# Altium schematic sheet PWR_F.SchDoc
size A3; Organization: Altium Limited; Address1: L3, 12a Rodborough Rd; Address2: Frenchs Forest; Address3: NSW; Address4: Australia 2086
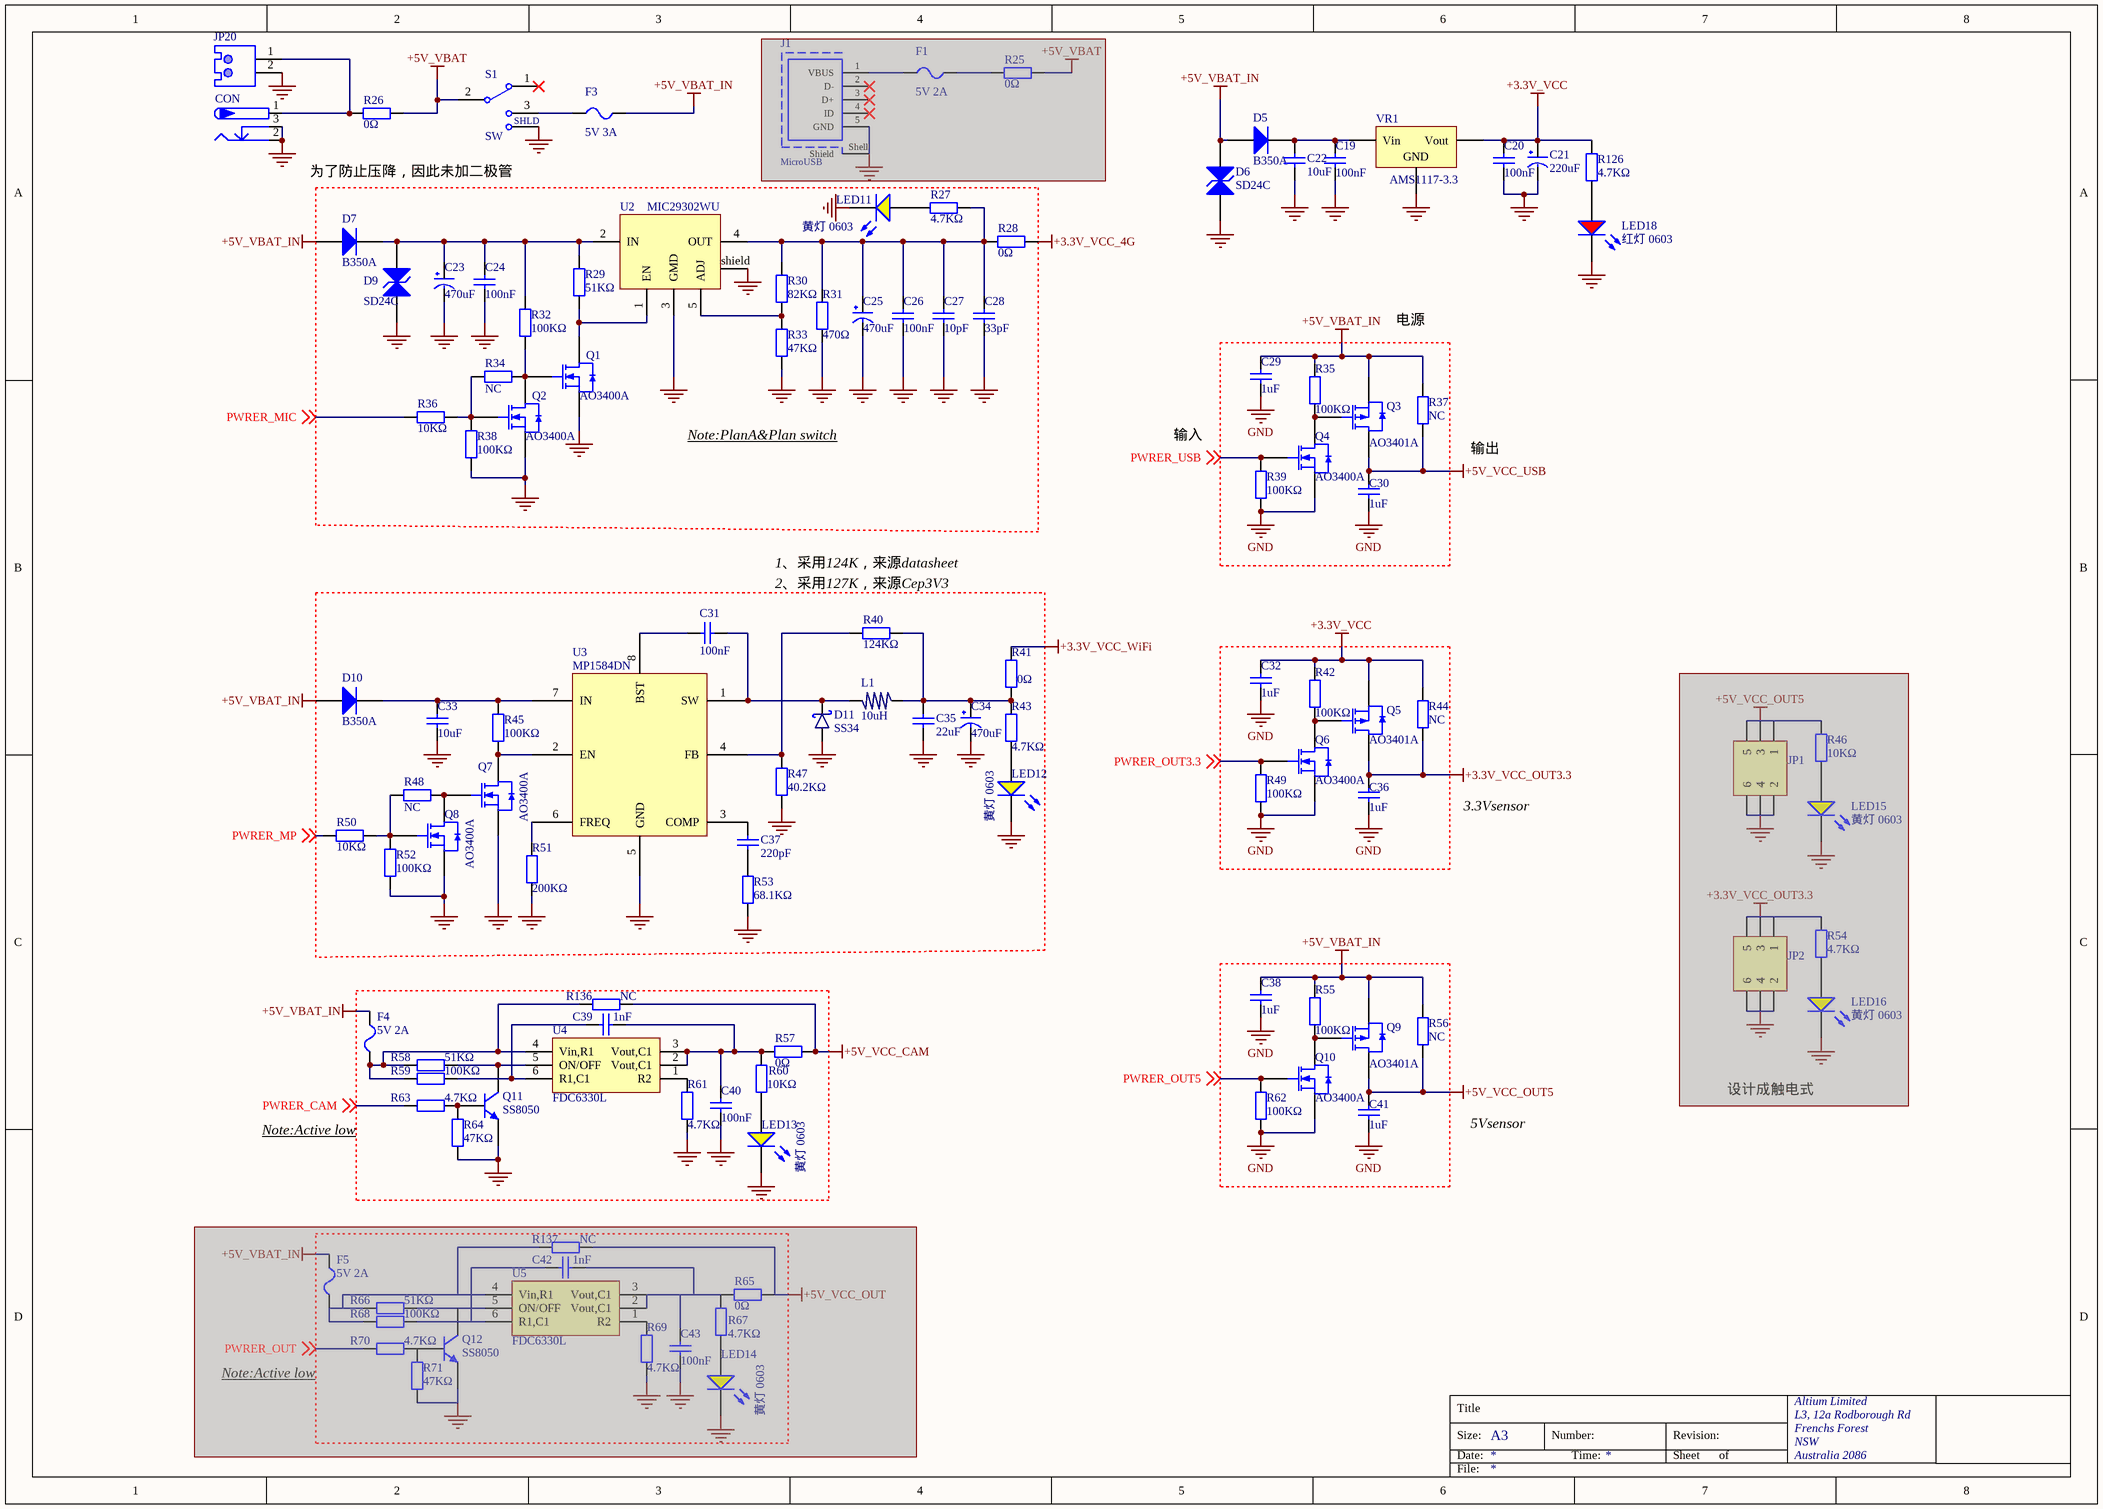
[diagram p0: PWR_F.SchDoc]

## Parts
C19  100nF  [0603_C]
C20  100nF  [0603_C]
C21  220uF  [CT 6*6 - C]
C22  10uF  [0805_C]
C23  470uF  [CT 8*7 - C]
C24  100nF  [0603_C]
C25  470uF  [CT 8*7 - C]
C26  100nF  [0603_C]
C27  10pF  [0603_C]
C28  33pF  [0603_C]
C29  1uF  [0603_C]
C30  1uF  [0603_C]
C31  100nF  [0603_C]
C32  1uF  [0603_C]
C33  10uF  [1206_C]
C34  470uF  [CT 8*7 - C]
C35  22uF  [0805_C]
C36  1uF  [0603_C]
C37  220pF  [0603_C]
C38  1uF  [0603_C]
C39  1nF  [0603_C]
C40  100nF  [0603_C]
C41  1uF  [0603_C]
C42  1nF  [0603_C]  (masked out: inside a compile mask, not in the netlist)
C43  100nF  [0603_C]  (masked out: inside a compile mask, not in the netlist)
CON  DC  [DC-005]  (value not drawn)
D5  B350A  [SMA(DO-214AC)_S1]
D6  SD24C  [SOD-323]
D7  B350A  [SMA(DO-214AC)_S1]
D9  SD24C  [SOD-323]
D10  B350A  [SMA(DO-214AC)_S1]
D11  SS34  [SMA(DO-214AC)_S1]
F1  5V 2A  [FU 0805]  (masked out: inside a compile mask, not in the netlist)
F3  5V 3A  [FU 0805]
F4  5V 2A  [FU 0805]
F5  5V 2A  [FU 0805]  (masked out: inside a compile mask, not in the netlist)
J1  MicroUSB  [MOLX-47589-0001]  (masked out: inside a compile mask, not in the netlist)
JP1  HDR-2X3  [HDR-3X2]  (value not drawn)  (masked out: inside a compile mask, not in the netlist)
JP2  HDR-2X3  [HDR-3X2]  (value not drawn)  (masked out: inside a compile mask, not in the netlist)
JP20  DC  [XH2.54-2P]  (value not drawn)
L1  10uH  [CDRH74]
LED11  黄灯 0603  [0603_LED_S1]
LED12  黄灯 0603  [0603_LED_S1]
LED13  黄灯 0603  [0603_LED_S1]
LED14  黄灯 0603  [0603_LED_S1]  (masked out: inside a compile mask, not in the netlist)
LED15  黄灯 0603  [0603_LED_S1]  (masked out: inside a compile mask, not in the netlist)
LED16  黄灯 0603  [0603_LED_S1]  (masked out: inside a compile mask, not in the netlist)
LED18  红灯 0603  [0603_LED_S1]
Q1  AO3400A  [SOT-23-3L]
Q2  AO3400A  [SOT-23-3L]
Q3  AO3401A  [SOT-23-3L]
Q4  AO3400A  [SOT-23-3L]
Q5  AO3401A  [SOT-23-3L]
Q6  AO3400A  [SOT-23-3L]
Q7  AO3400A  [SOT-23-3L]
Q8  AO3400A  [SOT-23-3L]
Q9  AO3401A  [SOT-23-3L]
Q10  AO3400A  [SOT-23-3L]
Q11  SS8050  [SOT-23(SOT-23-3)]
Q12  SS8050  [SOT-23(SOT-23-3)]  (masked out: inside a compile mask, not in the netlist)
R25  0Ω  [1206_R]  (masked out: inside a compile mask, not in the netlist)
R26  0Ω  [1206_R]
R27  4.7KΩ  [0603_R]
R28  0Ω  [1206_R]
R29  51KΩ  [0603_R]
R30  82KΩ  [0603_R]
R31  470Ω  [0603_R]
R32  100KΩ  [0603_R]
R33  47KΩ  [0603_R]
R34  NC  [0603_R]
R35  100KΩ  [0603_R]
R36  10KΩ  [0603_R]
R37  NC  [0603_R]
R38  100KΩ  [0603_R]
R39  100KΩ  [0603_R]
R40  124KΩ  [0603_R]
R41  0Ω  [1206_R]
R42  100KΩ  [0603_R]
R43  4.7KΩ  [0603_R]
R44  NC  [0603_R]
R45  100KΩ  [0603_R]
R46  10KΩ  [0603_R]  (masked out: inside a compile mask, not in the netlist)
R47  40.2KΩ  [0603_R]
R48  NC  [0603_R]
R49  100KΩ  [0603_R]
R50  10KΩ  [0603_R]
R51  200KΩ  [0603_R]
R52  100KΩ  [0603_R]
R53  68.1KΩ  [0603_R]
R54  4.7KΩ  [0603_R]  (masked out: inside a compile mask, not in the netlist)
R55  100KΩ  [0603_R]
R56  NC  [0603_R]
R57  0Ω  [1206_R]
R58  51KΩ  [0603_R]
R59  100KΩ  [0603_R]
R60  10KΩ  [0603_R]
R61  4.7KΩ  [0603_R]
R62  100KΩ  [0603_R]
R63  4.7KΩ  [0603_R]
R64  47KΩ  [0603_R]
R65  0Ω  [1206_R]  (masked out: inside a compile mask, not in the netlist)
R66  51KΩ  [0603_R]  (masked out: inside a compile mask, not in the netlist)
R67  4.7KΩ  [0603_R]  (masked out: inside a compile mask, not in the netlist)
R68  100KΩ  [0603_R]  (masked out: inside a compile mask, not in the netlist)
R69  4.7KΩ  [0603_R]  (masked out: inside a compile mask, not in the netlist)
R70  4.7KΩ  [0603_R]  (masked out: inside a compile mask, not in the netlist)
R71  47KΩ  [0603_R]  (masked out: inside a compile mask, not in the netlist)
R126  4.7KΩ  [0603_R]
R136  NC  [0603_R]
R137  NC  [0603_R]  (masked out: inside a compile mask, not in the netlist)
S1  SW  [SS-12F23 (1P2T)  Straight foot]
U2  MIC29302WU  [TO-263-5]
U3  MP1584DN  [SOP-8_150mil]
U4  FDC6330L  [SOT-23-6]
U5  FDC6330L  [SOT-23-6]  (masked out: inside a compile mask, not in the netlist)
VR1  AMS1117-3.3  [SOT-223]

## Blocks framed on the sheet
Note:PlanA&Plan switch: C23-C28 D7 D9 LED11 Q1 Q2 R27-R34 R36 R38 U2
电源: C29 C30 Q3 Q4 R35 R37 R39
2、采用127K，来源Cep3V3: C31 C33-C35 C37 D10 D11 L1 LED12 Q7 Q8 R40 R41 R43 R45 R47 R48 R50-R53 U3

## Nets
+3.3V_VCC: C20.2 C21.1(VCC) C32.2 Q5.2(S) R42.2 R44.2 R126.2 VR1.2(Vout)
+3.3V_VCC_4G: R28.2
+3.3V_VCC_OUT3.3: C36.2 Q5.3(D) R44.1
+3.3V_VCC_WiFi: R41.2
+5V_VBAT: R26.2 S1.2
+5V_VBAT_IN: C29.2 C38.2 D5.1(A) D6.2(K) D7.1(A) D10.1(A) F3.2 F4.2 Q3.2(S) Q9.2(S) R35.2 R37.2 R55.2 R56.2
+5V_VCC_CAM: R57.2 R136.2
+5V_VCC_OUT5: C41.2 Q9.3(D) R56.1
+5V_VCC_USB: C30.2 Q3.3(D) R37.1
GND: C19.1 C20.1 C21.2(GND) C22.1 C23.2(GND) C24.1 C25.2(GND) C26.1 C27.1 C28.1 C29.1 C30.1 C32.1 C33.2 C34.2(GND) C35.1 C36.1 C38.1 C40.1 C41.1 CON.2 CON.3 D6.1(A) D9.1(A) D11.1 JP20.2 LED11.K LED12.K LED13.K LED18.K Q1.2(S) Q2.2(S) Q4.2(S) Q6.2(S) Q7.2(S) Q8.2(S) Q10.2(S) Q11.2(E) R31.1 R33.1 R38.1 R39.1 R47.1 R49.1 R51.2 R52.1 R53.1 R61.2 R62.1 R64.2 S1.0(shield) U2.0(shield) U2.3(GMD) U3.5(GND) VR1.1(GND)
PWRER_CAM: R63.1 ; off-sheet PWRER_CAM
PWRER_MIC: R36.1 ; off-sheet PWRER_MIC
PWRER_MP: R50.1 ; off-sheet PWRER_MP
PWRER_OUT3.3: Q6.1(G) R49.2 ; off-sheet PWRER_OUT3.3
PWRER_OUT5: Q10.1(G) R62.2 ; off-sheet PWRER_OUT5
PWRER_USB: Q4.1(G) R39.2 ; off-sheet PWRER_USB
NetC19_2: C19.2 C22.2 D5.2(K) VR1.3(Vin)
NetC23_1: C23.1(VCC) C24.2 D7.2(K) D9.2(K) R29.2 R32.2 U2.2(IN)
NetC25_1: C25.1(VCC) C26.2 C27.2 C28.2 R27.2 R28.1 R30.2 R31.2 U2.4(OUT)
NetC31_1: C31.1 U3.8(BST)
NetC31_2: C31.2 D11.2 L1.2 U3.1(SW)
NetC33_1: C33.1 D10.2(K) R45.1 U3.7(IN)
NetC34_1: C34.1(VCC) C35.2 L1.1 R40.2 R41.1 R43.2
NetC37_1: C37.1 R53.2
NetC37_2: C37.2 U3.3(COMP)
NetC39_1: C39.1 C40.2 R57.1 R60.2 U4.2(Vout,C1) U4.3(Vout,C1)
NetC39_2: C39.2 R59.1 U4.6(R1,C1)
NetCON_1: CON.1 JP20.1 R26.1
NetF3_1: F3.1 S1.3
NetF4_1: F4.1 R58.2 R59.2 R136.1 U4.4(Vin,R1)
NetLED11_A: LED11.A R27.1
NetLED12_A: LED12.A R43.1
NetLED13_A: LED13.A R60.1
NetLED18_A: LED18.A R126.1
NetQ1_1: Q1.1(G) Q2.3(D) R32.1 R34.2
NetQ1_3: Q1.3(D) R29.1 U2.1(EN)
NetQ2_1: Q2.1(G) R34.1 R36.2 R38.2
NetQ3_1: Q3.1(G) Q4.3(D) R35.1
NetQ5_1: Q5.1(G) Q6.3(D) R42.1
NetQ7_1: Q7.1(G) Q8.3(D) R48.2
NetQ7_3: Q7.3(D) R45.2 U3.2(EN)
NetQ8_1: Q8.1(G) R48.1 R50.2 R52.2
NetQ9_1: Q9.1(G) Q10.3(D) R55.1
NetQ11_1: Q11.1(B) R63.2 R64.1
NetQ11_3: Q11.3(C) R58.1 U4.5(ON/OFF)
NetR30_1: R30.1 R33.2 U2.5(ADJ)
NetR40_1: R40.1 R47.2 U3.4(FB)
NetR51_1: R51.1 U3.6(FREQ)
NetR61_1: R61.1 U4.1(R2)

Not connected (* = marked no-connect by the designer): S1 1*

## Notes on the sheet
- 为了防止压降，因此未加二极管
- 输入
- (near R37) 输出
- 1、采用124K，来源datasheet
- 3.3Vsensor
- 5Vsensor
- 设计成触电式
- Note:Active low
- Title
- Size:
- Date:
- A3
- Number:
- Time:
- Revision:
- Sheet
- of
- File:
- *
- (in symbol SW SSW-1P_2) SHLD

## Library data of the parts
C19 C20 C24 C26 C31 C40 C43 = Cap 0603 100nF (104) 10% 50V: 贴片电容; ComponentLink1Description: 供应商链接; ComponentLink1URL: http://www.szlcsc.com/product/details_15331.html; Package: 0603; Supplier: LC; SuppliersPartNumber: C14663
C21 = Cap+ CT6.3*5.4 220uF/16V: 电解电容
C22 = Cap 0805 10uF (106) 10% 25V: 贴片电容; ComponentLink1Description: 供应商链接; ComponentLink1URL: http://www.szlcsc.com/product/details_16532.html; Package: 0805; Supplier: LC; SuppliersPartNumber: C15850; Value: 10uF
C23 C25 C34 = Cap+ CT8*10.2 470uF/16V: 电解电容
C27 = Cap 0603 10pF (100) 5% 50V: 贴片电容; ComponentLink1Description: 供应商链接; ComponentLink1URL: http://www.szlcsc.com/product/details_1986.html; Package: 0603; Supplier: LC; SuppliersPartNumber: C1634
C28 = Cap 0603 33pF (330) 5% 50V: 贴片电容; ComponentLink1Description: 供应商链接; ComponentLink1URL: http://www.szlcsc.com/product/details_2015.html; Package: 0603; Supplier: LC; SuppliersPartNumber: C1663
C29 C30 C32 C36 C38 C41 = Cap 0603 1uF (105) 10% 50V: 贴片电容; ComponentLink1Description: 供应商链接; ComponentLink1URL: http://www.szlcsc.com/product/details_16531.html; Package: 0603; Supplier: LC; SuppliersPartNumber: C15849
C33 = Cap 1206 10uF (106) 10% 50V: 贴片电容; ComponentLink1Description: 供应商链接; ComponentLink1URL: http://www.szlcsc.com/product/details_14236.html; Package: 1206; Supplier: LC; SuppliersPartNumber: C13585
C35 = Cap 0805 22uF (226) 20% 25V: 贴片电容; ComponentLink1Description: 供应商链接; ComponentLink1URL: http://www.szlcsc.com/product/details_46786.html; Package: 0805; Supplier: LC; SuppliersPartNumber: C45783
C37 = Cap 0603 220pF (221) 10% 50V: 贴片电容; ComponentLink1Description: 供应商链接; ComponentLink1URL: http://www.szlcsc.com/product/details_1955.html; Package: 0603; Supplier: LC; SuppliersPartNumber: C1603
C39 C42 = Cap 0603 1nF (102) 10% 50V: 贴片电容; ComponentLink1Description: 供应商链接; ComponentLink1URL: http://www.szlcsc.com/product/details_1940.html; Package: 0603; Supplier: LC; SuppliersPartNumber: C1588
CON = PWR-DC: 低压电源接口; BOM名称: DC电源接口; 版权归属: 源创客; 学习资源: www.ooocke.com
D5 D7 D10 = SMA(DO-214AC) B350A: Schottky Diodes; ComponentLink1Description: 供应商链接; ComponentLink1URL: http://www.szlcsc.com/product/details_2841.html; Package: SMA(DO-214AC)
D6 D9 = SOD-323 SD24C: TVS; ESD 抑制器/TVS 二极管; ComponentLink1Description: 供应商链接; ComponentLink1URL: http://www.szlcsc.com/product/details_79530.html; Package: SMB/DO-214AA; Supplier: LC; SuppliersPartNumber: C78395
D11 = SMA(DO-214AC) SS34: SMA(DO-214AC) SS34, D Schottky
F1 F4 F5 = FU PPTC MSMD 5V 2A: 自恢复保险丝; BOM名称: 贴片保险丝; 版权归属: 源创客; 学习资源: www.ooocke.com
F3 = FU PPTC MSMD 5V 3A: 自恢复保险丝; BOM名称: 贴片保险丝; 版权归属: 源创客; 学习资源: www.ooocke.com
J1 = MicroUSB MOLX-47589-0001: Right Angle Female Type AB Micro USB Connector, 30 V, 1.8 A, -30 to 85 degC, RoHS, Tape and Reel; Part Number: 629105150921; Manufacturer: Wurth Elektronik; Rated Current: 1.8A; Contact Resistance: 30mOhm; Gender: Receptacle; Working Voltage: 30VAC; Connector Type: MicroUSB2.0TypeAB; Publisher: WurthElektronik; Operating Temperature: -40to85degC; Packaging: TapeandReel; Datasheet URL: https://katalog.we-online.de/em/datasheet/629105150921.pdf; Mounting Technology: SMT; Orientation: Horizontal; Package Reference: 629105150921; Manufacturer URL: http://www.we-online.de
JP1 JP2 = Header HDR-2X3: 3*2P接插件; 版权归属: 源创客; BOM名称: 3*2P接插件; 学习资源: www.ooocke.com
JP20 = Header XH-2.56-2P: Male Header, Pitch 2.5 mm, 1 x 2 Position, Height 7 mm, Tail Length 3.4 mm, -25 to 85 degC, RoHS, Bulk; Manufacturer: JST; No of Positions: 2; Pitch: 2.5mm; Style/Orientation: StraightHeader/Plug; Datasheet Version: 05/2016; Package Description: Male Header, Pitch 2.5 mm, 1 x 2 Position, Height 7 mm, Tail Length 3.4 mm; Package Reference: B2B-XH-A; Mounting Technology: ThroughHole; Type: ShroudedHeader; Datasheet URL: http://www.jst-mfg.com/product/pdf/eng/eXH.pdf; Manufacturer URL: http://www.jst.com/home2.html; Termination: Crimp
L1 = IUD CDRH74 10uH
LED11-LED16 = LED 0603 黄灯: 发光二极管; ComponentLink1Description: 供应商链接; ComponentLink1URL: http://www.szlcsc.com/product/details_73147.html; Package: 0603; Supplier: LC; SuppliersPartNumber: C72038
LED18 = LED 0603 红灯: 发光二极管; ComponentLink1Description: 供应商链接; ComponentLink1URL: http://www.szlcsc.com/product/details_2659.html; Package: 0603; Supplier: LC; SuppliersPartNumber: C2286
Q1 Q2 Q4 Q6-Q8 Q10 = NMOS SOT-23 AO3400A X0YV1T: MOS(场效应管) NMOS; ComponentLink1Description: 供应商链接; ComponentLink1URL: http://www.szlcsc.com/product/details_21629.html; Package: SOT-23; Supplier: LC; SuppliersPartNumber: C20917
Q3 Q5 Q9 = PMOS SOT-23 AO3401A X13A15 : MOS(场效应管) PMOS; ComponentLink1Description: 供应商链接; ComponentLink1URL: http://www.szlcsc.com/product/details_15801.html; Package: SOT-23; Supplier: LC; SuppliersPartNumber: C15127
Q11 Q12 = NPN SOT-23 SS8050 Y1: NPN 三极管; ComponentLink1Description: 供应商链接; ComponentLink1URL: http://www.szlcsc.com/product/details_2507.html; Package: SOT-23; Supplier: LC; SuppliersPartNumber: C2150
R25 R26 R28 R41 R57 R65 = Res 1206 0Ω (0R0) 1%: 贴片电阻; ComponentLink1Description: 供应商链接; ComponentLink1URL: http://www.szlcsc.com/product/details_18576.html; Package: 1206; Supplier: LC; SuppliersPartNumber: C17888
R27 R43 R54 R61 R63 R67 R69 R70 R126 = Res 0603 4.7KΩ (4701) 1%: 贴片电阻; ComponentLink1Description: 供应商链接; ComponentLink1URL: http://www.szlcsc.com/product/details_23889.html; Package: 0603; Supplier: LC; SuppliersPartNumber: C23162
R29 R58 R66 = Res 0603 51KΩ (5102) 1%: 贴片电阻; ComponentLink1Description: 供应商链接; ComponentLink1URL: http://www.szlcsc.com/product/details_23923.html; Package: 0603; Supplier: LC; SuppliersPartNumber: C23196
R30 = Res 0603 82KΩ (8202) 1%: 贴片电阻; ComponentLink1Description: 供应商链接; ComponentLink1URL: http://www.szlcsc.com/product/details_26724.html; Package: 0603; Supplier: LC; SuppliersPartNumber: C25981
R31 = Res 0603 470Ω (4700) 1%: 贴片电阻; ComponentLink1Description: 供应商链接; ComponentLink1URL: http://www.szlcsc.com/product/details_23906.html; Package: 0603; Supplier: LC; SuppliersPartNumber: C23179
R32 R35 R38 R39 R42 R45 R49 R52 R55 R59 R62 R68 = Res 0603 100KΩ (1003) 1%: 贴片电阻; ComponentLink1Description: 供应商链接; ComponentLink1URL: http://www.szlcsc.com/product/details_26546.html; Package: 0603; Supplier: LC; SuppliersPartNumber: C25803
R33 R64 R71 = Res 0603 47KΩ (4702) 1%: 贴片电阻; ComponentLink1Description: 供应商链接; ComponentLink1URL: http://www.szlcsc.com/product/details_26562.html; Package: 0603; Supplier: LC; SuppliersPartNumber: C25819
R34 R37 R44 R48 R56 R136 R137 = Res 0603 0Ω (0R0) 1%: 贴片电阻; ComponentLink1Description: 供应商链接; ComponentLink1URL: http://www.szlcsc.com/product/details_21903.html; Package: 0603; Supplier: LC; SuppliersPartNumber: C21189
R36 R46 R50 R60 = Res 0603 10KΩ (1002) 1%: 贴片电阻; ComponentLink1Description: 供应商链接; ComponentLink1URL: http://www.szlcsc.com/product/details_26547.html; Package: 0603; Supplier: LC; SuppliersPartNumber: C25804
R40 = Res 0603 124KΩ 1%: 贴片电阻; ComponentLink1Description: 供应商链接; ComponentLink1URL: http://www.szlcsc.com/product/details_23702.html; Package: 0603; Supplier: LC; SuppliersPartNumber: C22975
R47 = Res 0603 40.2KΩ 1%: 贴片电阻; ComponentLink1Description: 供应商链接; ComponentLink1URL: http://www.szlcsc.com/product/details_23702.html; Package: 0603; Supplier: LC; SuppliersPartNumber: C22975
R51 = Res 0603 200KΩ (2003) 1%: 贴片电阻; ComponentLink1Description: 供应商链接; ComponentLink1URL: http://www.szlcsc.com/product/details_26554.html; Package: 0603; Supplier: LC; SuppliersPartNumber: C25811
R53 = Res 0603 68.1KΩ 1%: 贴片电阻; ComponentLink1Description: 供应商链接; ComponentLink1URL: http://www.szlcsc.com/product/details_23702.html; Package: 0603; Supplier: LC; SuppliersPartNumber: C22975
S1 = SW SSW-1P_2: 1路波动开关; BOM名称: 波动开关; 版权归属: 源创客; 学习资源: www.ooocke.com
U2 = MIC29302WU: 3A
U3 = MP1584DN: DC-DC电源芯片
U4 U5 = FDC6330L: Integrated Load Switch, 3 to 20 V, -55 to 150 degC, 6-Pin SOT23, RoHS, Tape and Reel, CMP-2000-04940-1; Manufacturer: Fairchild; Load Pulsed Current: 10A; Uni / Bi Directional Polarity: NP; No. of Outputs: 1; On / Enable Input Polarity: ActiveHigh; SMD Marking: 3544916; Power Dissipation Ptot Max: 0.7W; Continuous Drain Current Id: 2.3A; No. of Pins: 6; Protection Type: Yes; Power Load Switch Type: HighSide; Current Limit: 2.5A; Voltage Drop @ Vin 12V: 0.2V; Input Voltage Max: 20V; Transistor Polarity: NandPComplement; On State Resistance: 0.054ohm; Package Version: Rev. 5, 05/2015; On Resistance Rds(on): 0.08ohm; Voltage Off: 8V; No. of Transistors: 2; SVHC: NoSVHC(19-Dec-2012); Voltage In Min: 3V; Transistor Type: MOSFET; Operating Temperature Max: 150degC; Manufacturer URL: https://www.fairchildsemi.com/; Power Dissipation Pd: 0.7W; Package / Case: SuperSOT-6; Package URL: https://www.fairchildsemi.com/package-drawings/MA/MA06A.pdf; Datasheet URL: https://datasheet.ciiva.com/1572/276121-1572006.pdf; Package Reference: SOT23-6; Operating Temperature Range: -55degCto+150degC; Operating Temperature Min: -55degC; Drain Source Voltage Vds: 20V; Cont Load Current: 2.3A; Internal Switch: Yes; Voltage In Max: 20V; Distribution Switch Case Style: SSOT; Output Current Max: 10A; Input Voltage: 20V; Datasheet Version: Rev. C, 02/1999; Thermal Protection: Yes; Package Description: 6-Pin Small Outline Transistor, Body 2.9 x 1.6 mm, Pitch 0.95 mm; Pulse Current Idm: 10A
VR1 = SOT-223 AMS1117-3.3: 低压差线性稳压(LDO); ComponentLink1Description: 供应商链接; ComponentLink1URL: http://www.szlcsc.com/product/details_6652.html; Package: SOT-223; Supplier: LC; SuppliersPartNumber: C6186